# Altium schematic sheet Artemis Dionysus Connectors.SchDoc: Dionysus Connectors
size Tabloid; Date: 7/17/2014; CompanyName: Cospan Design LLC; DocumentNumber: 13; SheetNumber: 13; SheetTotal: 18
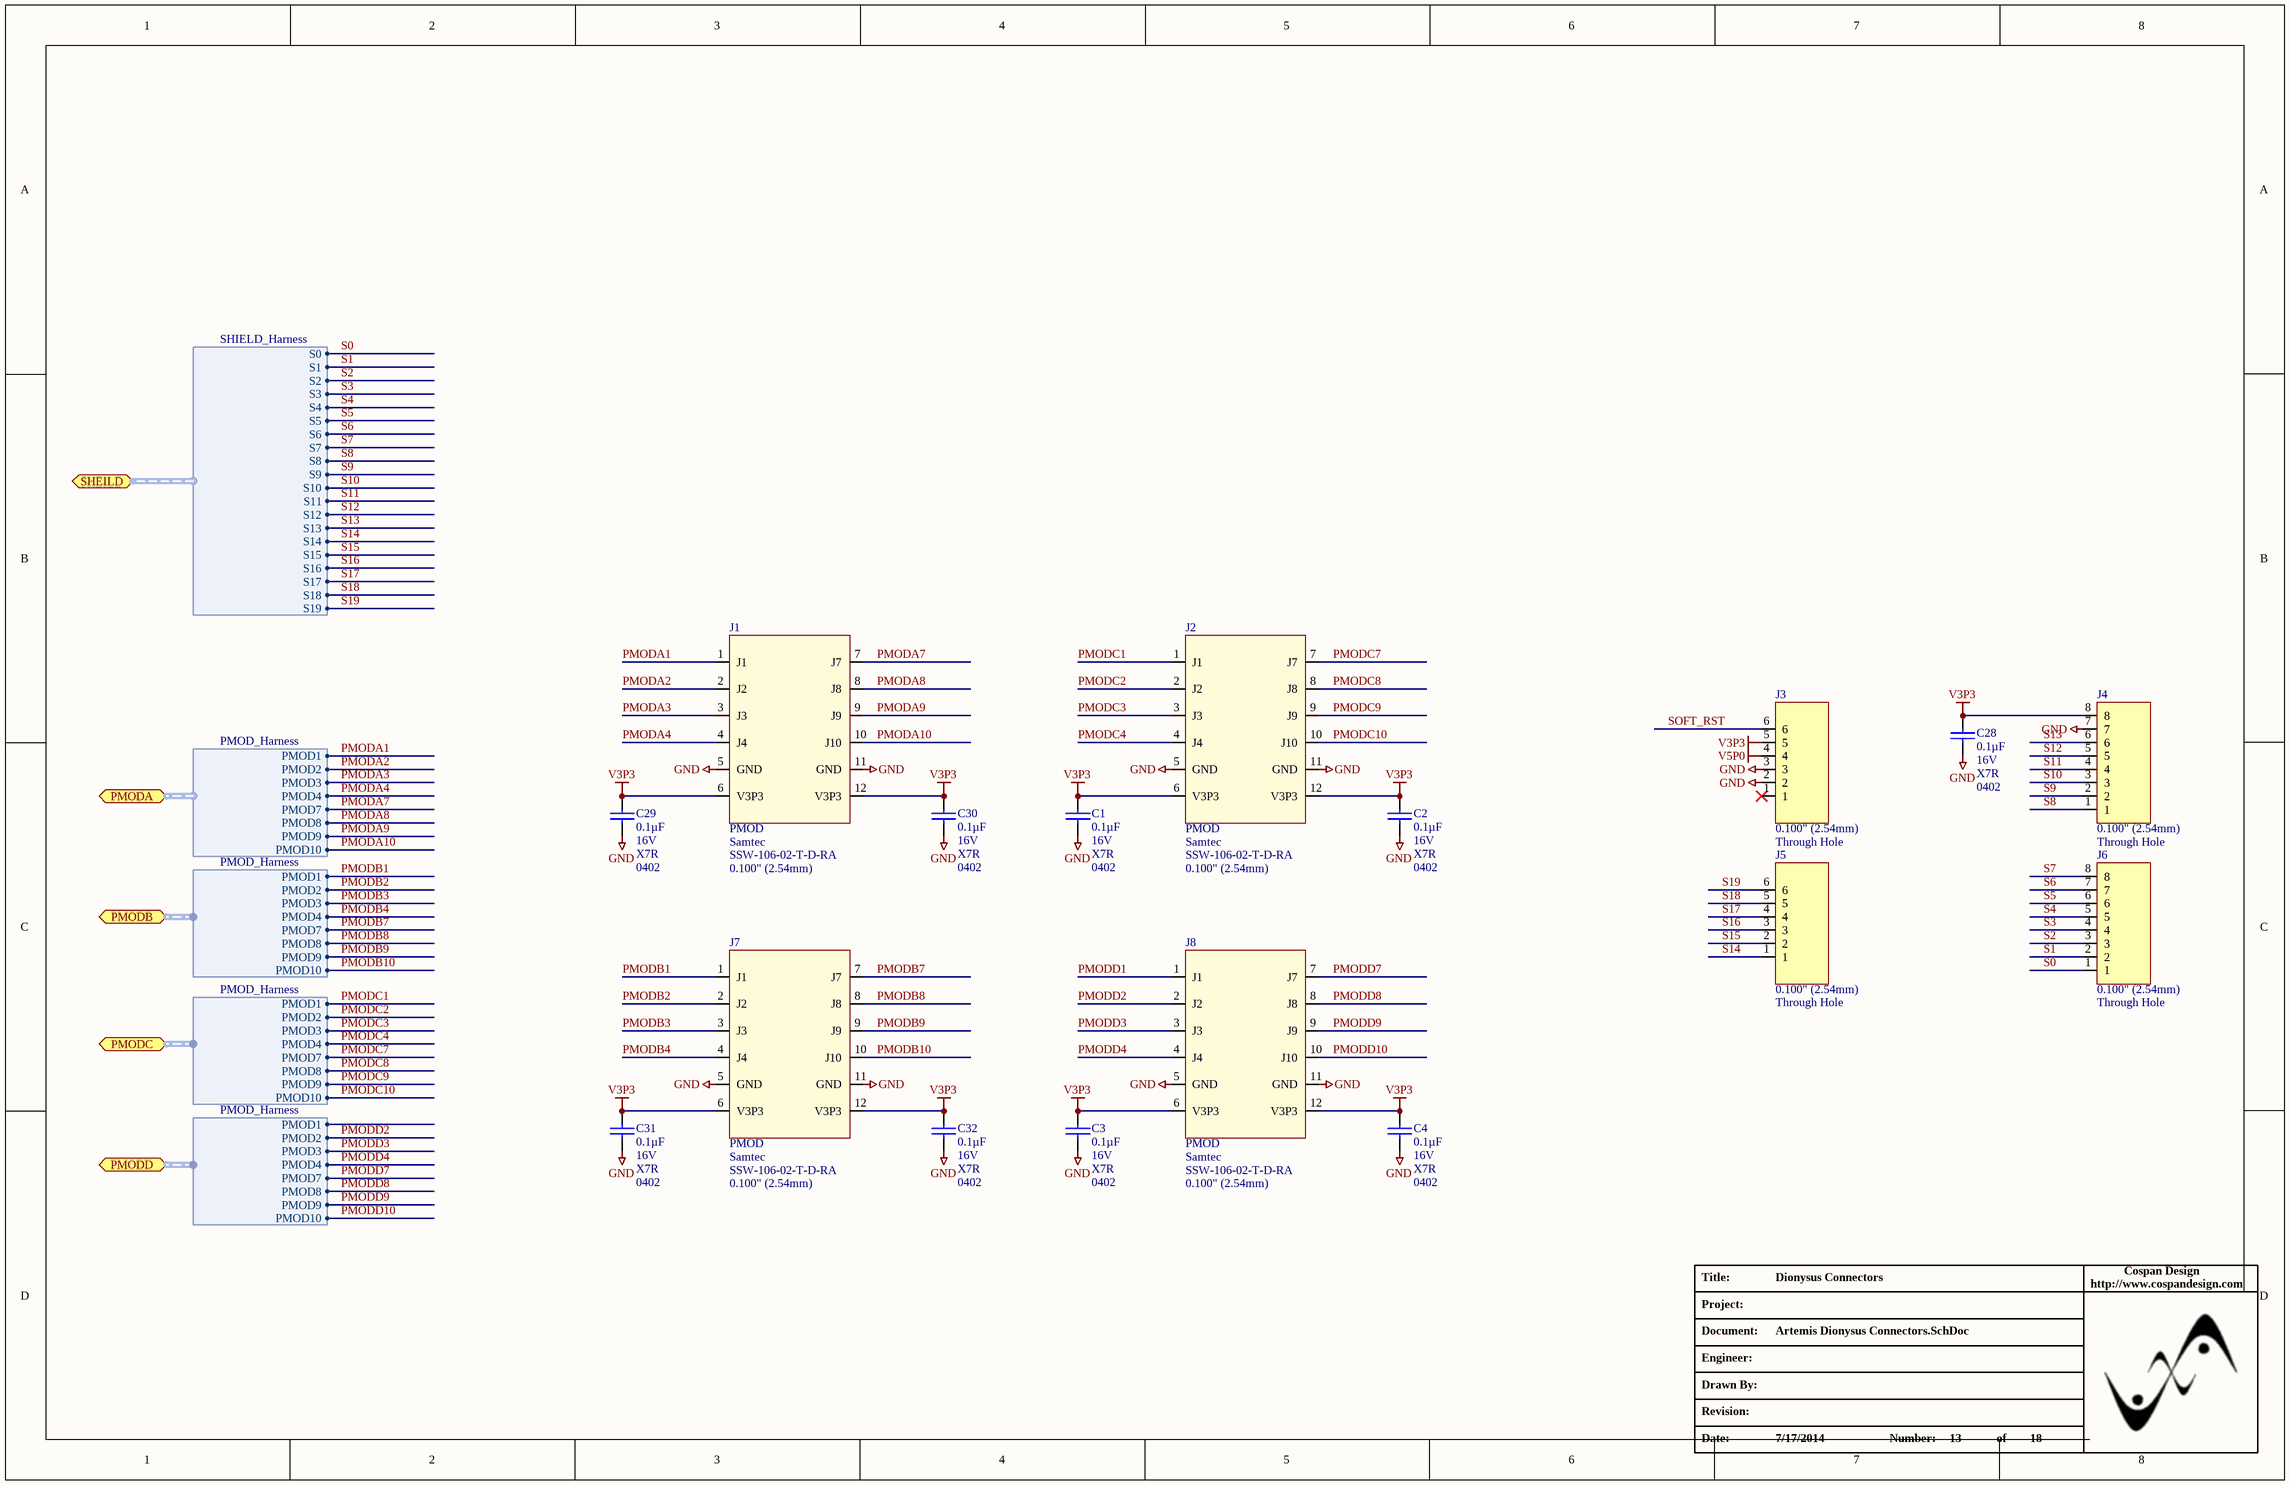
[diagram p0: Artemis Dionysus Connectors.SchDoc]

## Parts
C1  Capacitance: 0.1µF  Voltage - Rated: 16V  Temperature Coefficient: X7R  Package / Case: 0402  [C_ERA-0402]  (hidden comment: 0.1uF)
C2  Capacitance: 0.1µF  Voltage - Rated: 16V  Temperature Coefficient: X7R  Package / Case: 0402  [C_ERA-0402]  (hidden comment: 0.1uF)
C3  Capacitance: 0.1µF  Voltage - Rated: 16V  Temperature Coefficient: X7R  Package / Case: 0402  [C_ERA-0402]  (hidden comment: 0.1uF)
C4  Capacitance: 0.1µF  Voltage - Rated: 16V  Temperature Coefficient: X7R  Package / Case: 0402  [C_ERA-0402]  (hidden comment: 0.1uF)
C28  Capacitance: 0.1µF  Voltage - Rated: 16V  Temperature Coefficient: X7R  Package / Case: 0402  [C_ERA-0402]  (hidden comment: 0.1uF)
C29  Capacitance: 0.1µF  Voltage - Rated: 16V  Temperature Coefficient: X7R  Package / Case: 0402  [C_ERA-0402]  (hidden comment: 0.1uF)
C30  Capacitance: 0.1µF  Voltage - Rated: 16V  Temperature Coefficient: X7R  Package / Case: 0402  [C_ERA-0402]  (hidden comment: 0.1uF)
C31  Capacitance: 0.1µF  Voltage - Rated: 16V  Temperature Coefficient: X7R  Package / Case: 0402  [C_ERA-0402]  (hidden comment: 0.1uF)
C32  Capacitance: 0.1µF  Voltage - Rated: 16V  Temperature Coefficient: X7R  Package / Case: 0402  [C_ERA-0402]  (hidden comment: 0.1uF)
J1  PMOD  Manufacturer: Samtec  Manufacturer Part Number: SSW-106-02-T-D-RA  Pitch: 0.100" (2.54mm)  [PMOD]
J2  PMOD  Manufacturer: Samtec  Manufacturer Part Number: SSW-106-02-T-D-RA  Pitch: 0.100" (2.54mm)  [PMOD]
J3  Pitch: 0.100" (2.54mm)  Mounting Type: Through Hole  [HDR_1X6 - FEMALE]  (hidden comment: J_HDR1X6_THRHOLE_VERT_FEMALE)
J4  Pitch: 0.100" (2.54mm)  Mounting Type: Through Hole  [HDR_1X8 - FEMALE]  (hidden comment: J_HDR1X8_THRHOLE_VERT_RECPT)
J5  Pitch: 0.100" (2.54mm)  Mounting Type: Through Hole  [HDR_1X6 - FEMALE]  (hidden comment: J_HDR1X6_THRHOLE_VERT_FEMALE)
J6  Pitch: 0.100" (2.54mm)  Mounting Type: Through Hole  [HDR_1X8 - FEMALE]  (hidden comment: J_HDR1X8_THRHOLE_VERT_RECPT)
J7  PMOD  Manufacturer: Samtec  Manufacturer Part Number: SSW-106-02-T-D-RA  Pitch: 0.100" (2.54mm)  [PMOD]
J8  PMOD  Manufacturer: Samtec  Manufacturer Part Number: SSW-106-02-T-D-RA  Pitch: 0.100" (2.54mm)  [PMOD]

## Ports
PMODA (harness PMOD_Harness), PMODB (harness PMOD_Harness), PMODC (harness PMOD_Harness), PMODD (harness PMOD_Harness), SHEILD (harness SHIELD_Harness)

## Harnesses
SHIELD_Harness: S0, S1, S2, S3, S4, S5, S6, S7, S8, S9, S10, S11, S12, S13, S14, S15, S16, S17, S18, S19
PMOD_Harness: PMOD1, PMOD2, PMOD3, PMOD4, PMOD7, PMOD8, PMOD9, PMOD10

## Nets
GND: C1.1 C2.1 C3.1 C4.1 C28.1 C29.1 C30.1 C31.1 C32.1 J1.5(GND) J1.11(GND) J2.5(GND) J2.11(GND) J3.2 J3.3 J4.7 J7.5(GND) J7.11(GND) J8.5(GND) J8.11(GND)
V3P3: C1.2 C2.2 C3.2 C4.2 C28.2 C29.2 C30.2 C31.2 C32.2 J1.6(V3P3) J1.12(V3P3) J2.6(V3P3) J2.12(V3P3) J3.5 J4.8 J7.6(V3P3) J7.12(V3P3) J8.6(V3P3) J8.12(V3P3)
V5P0: J3.4
PMODA1: J1.1(J1) ; port PMODA.PMOD1
PMODA2: J1.2(J2) ; port PMODA.PMOD2
PMODA3: J1.3(J3) ; port PMODA.PMOD3
PMODA4: J1.4(J4) ; port PMODA.PMOD4
PMODA7: J1.7(J7) ; port PMODA.PMOD7
PMODA8: J1.8(J8) ; port PMODA.PMOD8
PMODA9: J1.9(J9) ; port PMODA.PMOD9
PMODA10: J1.10(J10) ; port PMODA.PMOD10
PMODB1: J7.1(J1) ; port PMODB.PMOD1
PMODB2: J7.2(J2) ; port PMODB.PMOD2
PMODB3: J7.3(J3) ; port PMODB.PMOD3
PMODB4: J7.4(J4) ; port PMODB.PMOD4
PMODB7: J7.7(J7) ; port PMODB.PMOD7
PMODB8: J7.8(J8) ; port PMODB.PMOD8
PMODB9: J7.9(J9) ; port PMODB.PMOD9
PMODB10: J7.10(J10) ; port PMODB.PMOD10
PMODC1: J2.1(J1) ; port PMODC.PMOD1
PMODC2: J2.2(J2) ; port PMODC.PMOD2
PMODC3: J2.3(J3) ; port PMODC.PMOD3
PMODC4: J2.4(J4) ; port PMODC.PMOD4
PMODC7: J2.7(J7) ; port PMODC.PMOD7
PMODC8: J2.8(J8) ; port PMODC.PMOD8
PMODC9: J2.9(J9) ; port PMODC.PMOD9
PMODC10: J2.10(J10) ; port PMODC.PMOD10
PMODD1: J8.1(J1)
PMODD2: J8.2(J2) ; port PMODD.PMOD2
PMODD3: J8.3(J3) ; port PMODD.PMOD3
PMODD4: J8.4(J4) ; port PMODD.PMOD4
PMODD7: J8.7(J7) ; port PMODD.PMOD7
PMODD8: J8.8(J8) ; port PMODD.PMOD8
PMODD9: J8.9(J9) ; port PMODD.PMOD9
PMODD10: J8.10(J10) ; port PMODD.PMOD10
S0: J6.1 ; port SHEILD.S0
S1: J6.2 ; port SHEILD.S1
S2: J6.3 ; port SHEILD.S2
S3: J6.4 ; port SHEILD.S3
S4: J6.5 ; port SHEILD.S4
S5: J6.6 ; port SHEILD.S5
S6: J6.7 ; port SHEILD.S6
S7: J6.8 ; port SHEILD.S7
S8: J4.1 ; port SHEILD.S8
S9: J4.2 ; port SHEILD.S9
S10: J4.3 ; port SHEILD.S10
S11: J4.4 ; port SHEILD.S11
S12: J4.5 ; port SHEILD.S12
S13: J4.6 ; port SHEILD.S13
S14: J5.1 ; port SHEILD.S14
S15: J5.2 ; port SHEILD.S15
S16: J5.3 ; port SHEILD.S16
S17: J5.4 ; port SHEILD.S17
S18: J5.5 ; port SHEILD.S18
S19: J5.6 ; port SHEILD.S19
SOFT_RST: J3.6

Not connected (* = marked no-connect by the designer): J3 1*

## Notes on the sheet
- Title:
- http://www.cospandesign.com
- Cospan Design
- Project:
- Document:
- Engineer:
- Revision:
- Drawn By:
- Date:
- Number:
- of

## Library data of the parts
C1-C4 C28-C32 = C_0402_0.1UF_16V: CAP CER .10UF 16V X7R 0402; Manufacturer: TDK Corporation; Manufacturer Part Number: C1005X7R1C104K; Tolerance: ±10%; Supplier 1: Digi-Key; Supplier Part Number 1: 445-4952-1-ND; RoHS: RoHS Compliant; Category: Capacitors; Stock 1: 230800; Pricing: 10=0.024, 100=0.0143, 500=0.00826, 1000=0.00572 (USD); Mounting Type: Surface Mount, MLCC; Features: General Purpose; Lead Spacing: -; Thickness: 0.50mm; Packaging: Cut Tape (CT); ComponentLink1URL: http://www.tdk.co.jp/tefe02/e412_c.pdf; ComponentLink1Description: http://www.tdk.co.jp/tefe02/e412_c.pdf; Operating Temperature: -55°C ~ 125°C
J1 J2 J7 J8 = J_PMOD: CONN FEMALE 12POS DL .1" R/A TIN; Connector Type: Header; Number of Positions: 12; Number of Positions Loaded: All; Supplier 1: Samtec; Supplier Part Number 1: SSW-106-02-T-D-RA; Category: Connectors, Interconnects; Stock 1: 890; Contact Type: Female Socket; Number of Rows: 2; Row Spacing: 0.100" (2.54mm); Mounting Type: Through Hole, Right Angle; Termination: Solder; Fastening Type: -; Features: -; Contact Finish: Tin; Contact Finish Thickness: -; Color: Black; ComponentLink1URL: http://www.sullinscorp.com/drawings/101_xPxCxx2LJBN-RC,_10494-C.pdf; ComponentLink1Description: http://www.sullinscorp.com/drawings/101_xPxCxx2LJBN-RC,_10494-C.pdf; Pricing: 1=0.723
J3 J5 = J_HDR1X6_THRHOLE_VERT_FEMALE: CONN HEADER FEMALE 6POS .1" TIN; Manufacturer: Samtec; Manufacturer Part Number: SSW-106-01-T-S; Number of Positions: 6; Number of Positions Loaded: All; Supplier 1: Samtec; Supplier Part Number 1: SSW-106-01-T-S; Category: Connectors, Interconnects; Connector Type: Header; Contact Type: Female Socket; Number of Rows: 1; Termination: Solder; Contact Finish: Tin; Contact Finish Thickness: -; Color: Black; ComponentLink1URL: http://www.sullinscorp.com/drawings/101_xPxCxxxLFBN-RC,_10492-D.pdf; ComponentLink1Description: http://www.sullinscorp.com/drawings/101_xPxCxxxLFBN-RC,_10492-D.pdf; Pricing: 0.373
J4 J6 = J_HDR1X8_THRHOLE_VERT_FEMALE: CONN HEADER FEMALE 8POS .1" TIN; Manufacturer: Samtec; Manufacturer Part Number: SSW-108-01-T-S; Number of Positions: 8; Number of Positions Loaded: All; Supplier 1: Samtec; Supplier Part Number 1: SSW-108-01-T-S; RoHS: RoHS Compliant; Category: Connectors, Interconnects; Connector Type: Header; Contact Type: Female Socket; Number of Rows: 1; Termination: Solder; Fastening Type: -; Features: -; Contact Finish: Tin; Contact Finish Thickness: -; Color: Black; ComponentLink1URL: http://www.sullinscorp.com/drawings/101_xPxCxxxLFBN-RC,_10492-D.pdf; ComponentLink1Description: http://www.sullinscorp.com/drawings/101_xPxCxxxLFBN-RC,_10492-D.pdf; Pricing: 1=0.497